# EAGLE design AP_KACA (EAGLE 8.4.1)
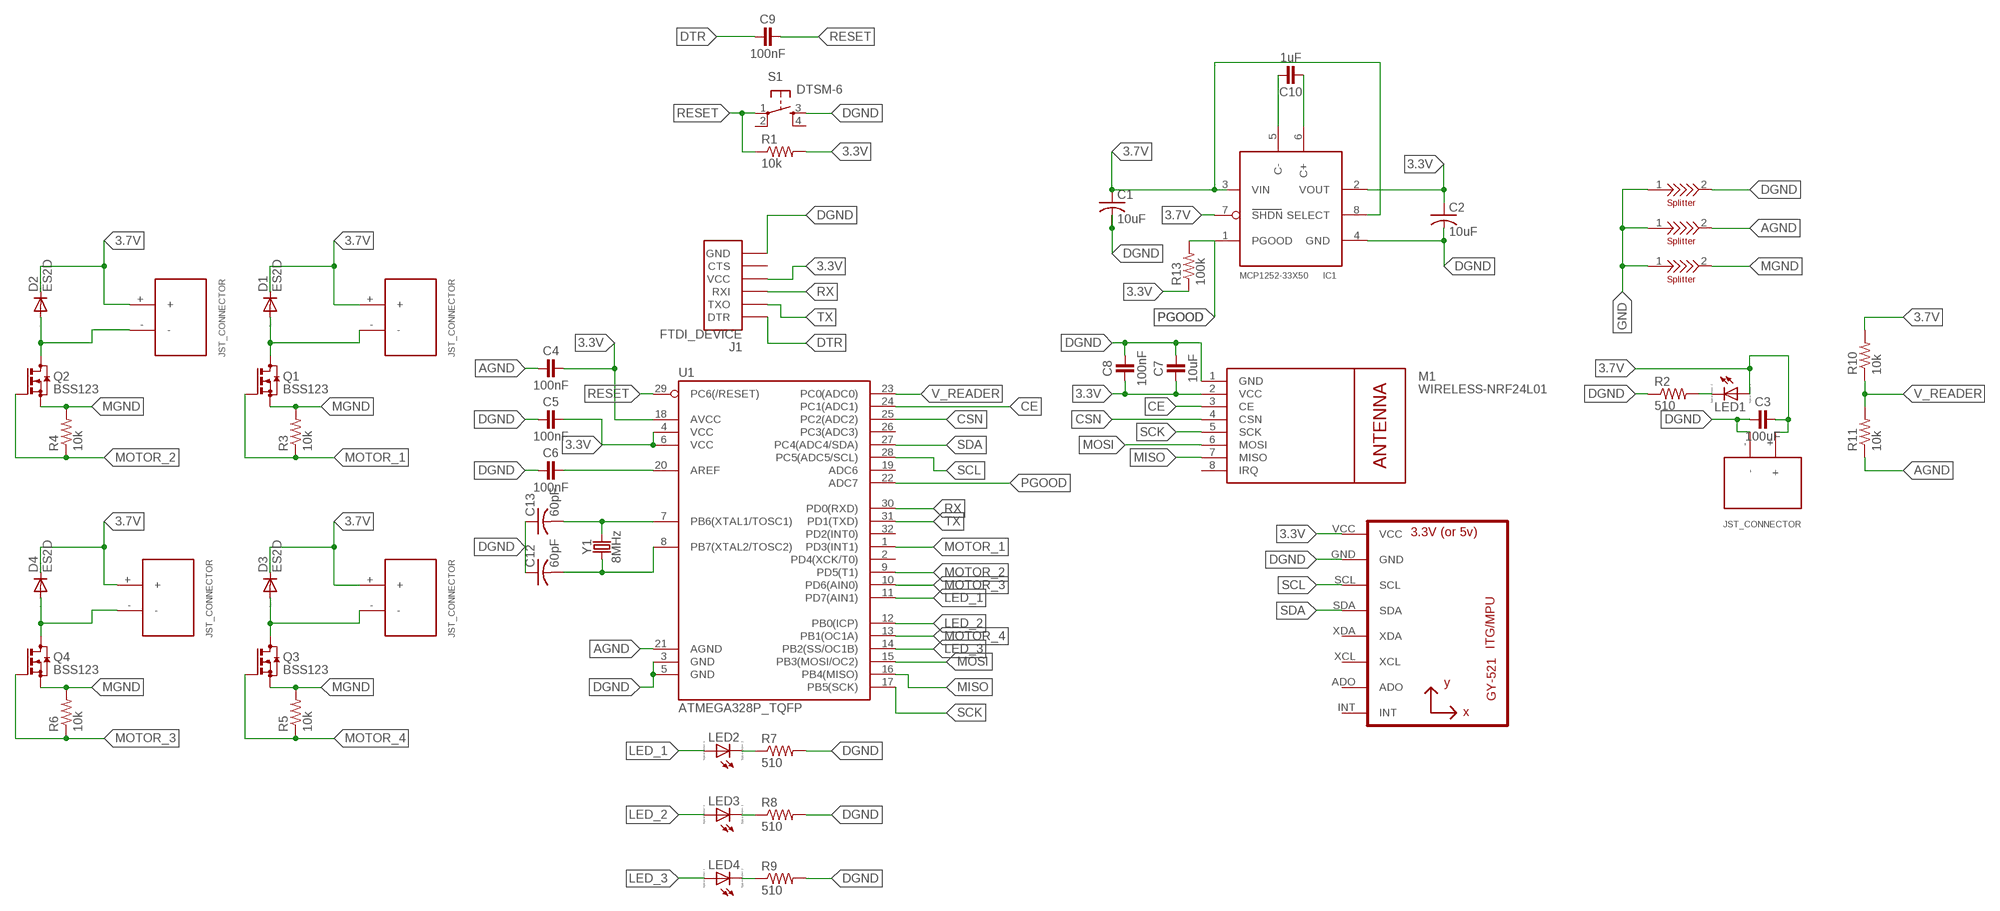
[diagram p0: schematic, sheet 1]

## Parts
C1  10uF  C-USC1206  [C1206]
C2  10uF  C-USC1206  [C1206]
C3  100uF  CAPACITOR-1206  [C1206]
C4  100nF  CAPACITOR-0603  [C0603]
C5  100nF  CAPACITOR-0603  [C0603]
C6  100nF  CAPACITOR-0603  [C0603]
C7  10uF  CAPACITOR-0603  [C0603]
C8  100nF  CAPACITOR-0603  [C0603]
C9  100nF  CAPACITOR-0603  [C0603]
C10  1uF  CAPACITOR-0603  [C0603]
C12  60pF  RCL_C-USC1206  [RCL_C1206]
C13  60pF  RCL_C-USC1206  [RCL_C1206]
D1  ES2D  [SMB]
D2  ES2D  [SMB]
D3  ES2D  [SMB]
D4  ES2D  [SMB]
IC1  MCP1252-33X50  [MSOP8]
J1  FTDI_DEVICE  [FTDI_DEVICE_SIDE]
JST_MOTOR_1  JST_MOTOR_1  JST_CONNECTOR_FEMALE  [JST_CONNECTOR_FEMALE]
LED1  LED_ESML0603  [LED_SML0603]
LED2  LED_ESML0603  [LED_SML0603]
LED3  LED_ESML0603  [LED_SML0603]
LED4  LED_ESML0603  [LED_SML0603]
M1  WIRELESS-NRF24L01  [WIRELESS-NRF24L01]
Q1  BSS123  [SOT23]
Q2  BSS123  [SOT23]
Q3  BSS123  [SOT23]
Q4  BSS123  [SOT23]
R1  10k  10.5KOHM1/10W1%(0603)  [0603]
R2  510  10.5KOHM1/10W1%(0603)  [0603]
R3  10k  10.5KOHM1/10W1%(0603)  [0603]
R4  10k  10.5KOHM1/10W1%(0603)  [0603]
R5  10k  10.5KOHM1/10W1%(0603)  [0603]
R6  10k  10.5KOHM1/10W1%(0603)  [0603]
R7  510  10.5KOHM1/10W1%(0603)  [0603]
R8  510  10.5KOHM1/10W1%(0603)  [0603]
R9  510  10.5KOHM1/10W1%(0603)  [0603]
R10  10k  10.5KOHM1/10W1%(0603)  [0603]
R11  10k  10.5KOHM1/10W1%(0603)  [0603]
R13  100k  10.5KOHM1/10W1%(0603)  [0603]
S1  DTSM-6  [DTSM-6]
U1  ATMEGA328P_TQFP  [TQFP32-08]
U3  GY-521MPU6050  [GY-521]
U$2  JST_CONNECTOR_FEMALE  [JST_CONNECTOR_FEMALE]
U$3  JST_CONNECTOR_FEMALE  [JST_CONNECTOR_FEMALE]
U$4  JST_CONNECTOR_FEMALE  [JST_CONNECTOR_FEMALE]
U$5  JST_CONNECTOR_FEMALE  [JST_CONNECTOR_FEMALE]
U$6  SPLITTER  [SPLITTER]
U$7  SPLITTER  [SPLITTER]
U$8  SPLITTER  [SPLITTER]
Y1  8MHz  CRYSTAL-8MHZSMD-HC49UP  [HC49UP]

## Nets
3.3V: C2.1 C4.2 C5.2 C7.1 C8.1 IC1.2(VOUT) J1.P$4(VCC) M1.2(VCC) R1.2 R13.1 U1.4(VCC) U1.6(VCC) U1.18(AVCC) U3.VCC
3.7V: C1.1 C3.2 D1.C D2.C D3.C D4.C IC1.3(VIN) IC1.7(SHDN) IC1.8(SELECT) JST_MOTOR_1.+ LED1.A R10.2 U$2.+ U$3.+ U$4.+ U$5.+
AGND: C4.1 R11.1 U1.21(AGND) U$6.2
CE: M1.3(CE) U1.24(PC1(ADC1))
CSN: M1.4(CSN) U1.25(PC2(ADC2))
DGND: C1.2 C2.2 C3.1 C5.1 C6.1 C7.2 C8.2 C12.1 C13.1 IC1.4(GND) J1.P$6(GND) M1.1(GND) R2.1 R7.2 R8.2 R9.2 S1.3 U1.3(GND) U1.5(GND) U3.GND U$2.- U$8.2
DTR: C9.1 J1.P$1(DTR)
GND: U$6.1 U$7.1 U$8.1
LED_1: LED2.A U1.11(PD7(AIN1))
LED_2: LED3.A U1.12(PB0(ICP))
LED_3: LED4.A U1.14(PB2(SS/OC1B))
MGND: Q1.2(S) Q2.2(S) Q3.2(S) Q4.2(S) R3.2 R4.2 R5.2 R6.2 U$7.2
MISO: M1.7(MISO) U1.16(PB4(MISO))
MOSI: M1.6(MOSI) U1.15(PB3(MOSI/OC2))
MOTOR_1: Q1.1(G) R3.1 U1.1(PD3(INT1))
MOTOR_2: Q2.1(G) R4.1 U1.9(PD5(T1))
MOTOR_3: Q4.1(G) R6.1 U1.10(PD6(AIN0))
MOTOR_4: Q3.1(G) R5.1 U1.13(PB1(OC1A))
N$1: D2.A Q2.3(D) U$3.-
N$2: D1.A JST_MOTOR_1.- Q1.3(D)
N$3: D3.A Q3.3(D) U$5.-
N$4: D4.A Q4.3(D) U$4.-
N$5: LED1.C R2.2
N$6: C13.2 U1.7(PB6(XTAL1/TOSC1)) Y1.2
N$7: C12.2 U1.8(PB7(XTAL2/TOSC2)) Y1.1
N$9: C6.2 U1.20(AREF)
N$11: C10.2 IC1.5(C-)
N$12: C10.1 IC1.6(C+)
N$15: LED3.C R8.1
N$16: LED2.C R7.1
N$17: LED4.C R9.1
PGOOD: IC1.1(PGOOD) R13.2 U1.22(ADC7)
RESET: C9.2 R1.1 S1.1 U1.29(PC6(/RESET))
RX: J1.P$3(RXI) U1.30(PD0(RXD))
SCK: M1.5(SCK) U1.17(PB5(SCK))
SCL: U1.28(PC5(ADC5/SCL)) U3.SCL
SDA: U1.27(PC4(ADC4/SDA)) U3.SDA
TX: J1.P$2(TXO) U1.31(PD1(TXD))
V_READER: R10.1 R11.2 U1.23(PC0(ADC0))
Unconnected: J1.P$5(CTS) M1.8(IRQ) S1.2 S1.4 U1.2(PD4(XCK/T0)) U1.19(ADC6) U1.26(PC3(ADC3)) U1.32(PD2(INT0)) U3.ADO U3.INT U3.XCL U3.XDA

## Library data of the parts
C1 C2 = resistor:C-US: CAPACITOR, American symbol
C3-C10 = we-rcl:CAPACITOR: Capacitors ...2.2uF @ 6.3V -> 0402 ...4.7uF @ 6.3V -> 0603 ...10uF @ 16V -> 0805 ...22uF @ 25V -> 1206
C12 C13 = OPS_Project_6_LIB:RCL_C-US: CAPACITOR, American symbol
D1-D4 = diode:ES2D: DIODE super fast rectifier, 2 A
IC1 = microchip-MCP125x-xxx:MCP1252-33X50: 650KHz 3.3V / 5.0V Selectable Switching Regulator
J1 = quad:FTDI_DEVICE: Connector which mates to FTDI basic or FTDI cable.
JST_MOTOR_1 U$2-U$5 = JST_CONNECTOR_FEMALE. through hole:JST_CONNECTOR_FEMALE
LED1-LED4 = eagle-ltspice:LED_E: LED Source: http://www.osram.convergy.de Source: www.luxeon.com Source: www.kingbright.com; SPICEMODEL: NONE; SPICEPREFIX: D; SPICETYPE: diode
M1 = quad:WIRELESS-NRF24L01: 2.4 GHz Wireless Module based on NRF24L01 chip
Q1-Q4 = transistor-small-signal:BSS123: N-CHANNEL MOS FET
R1-R11 R13 = SparkFun-Resistors:10.5KOHM1/10W1%(0603): RES-09570; PROD_ID: RES-09570; VALUE: 10.5k
S1 = switch-tact:DTSM-6
U1 = quad:ATMEGA328P_TQFP; PROD_ID: IC-09069
U3 = quad:GY-521
U$6-U$8 = splitter:SPLITTER
Y1 = SparkFun-Clocks:CRYSTAL-8MHZ: 8MHz Crystal Datasheet Example <http://www.futureelectronics.com/en/technologies/electromechanical/timing-devices/crystals/Pages/6008189-ABM3B-8.000MHZ-B2-T.aspx?IM=0> Frequency: 8MHz Frequency Tolerance: ±20ppm Load Capacitance: 18pF SparkFun Products: Pro Micro -3.3V/8MHz <https://www.sparkfun.com/products/12587> WAV Trigger <https://www.sparkfun.com/products/13660>; PROD_ID: XTAL-11706

## Board
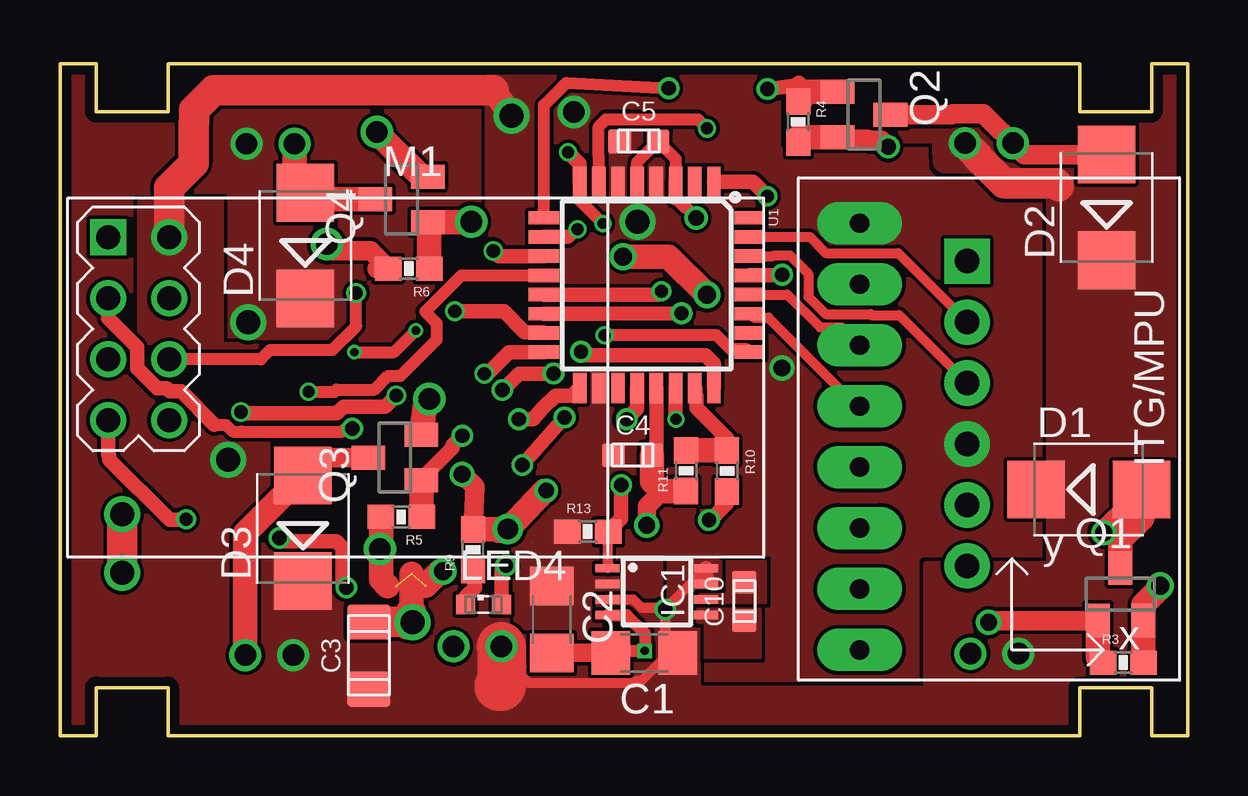
[diagram p1: board, top side]
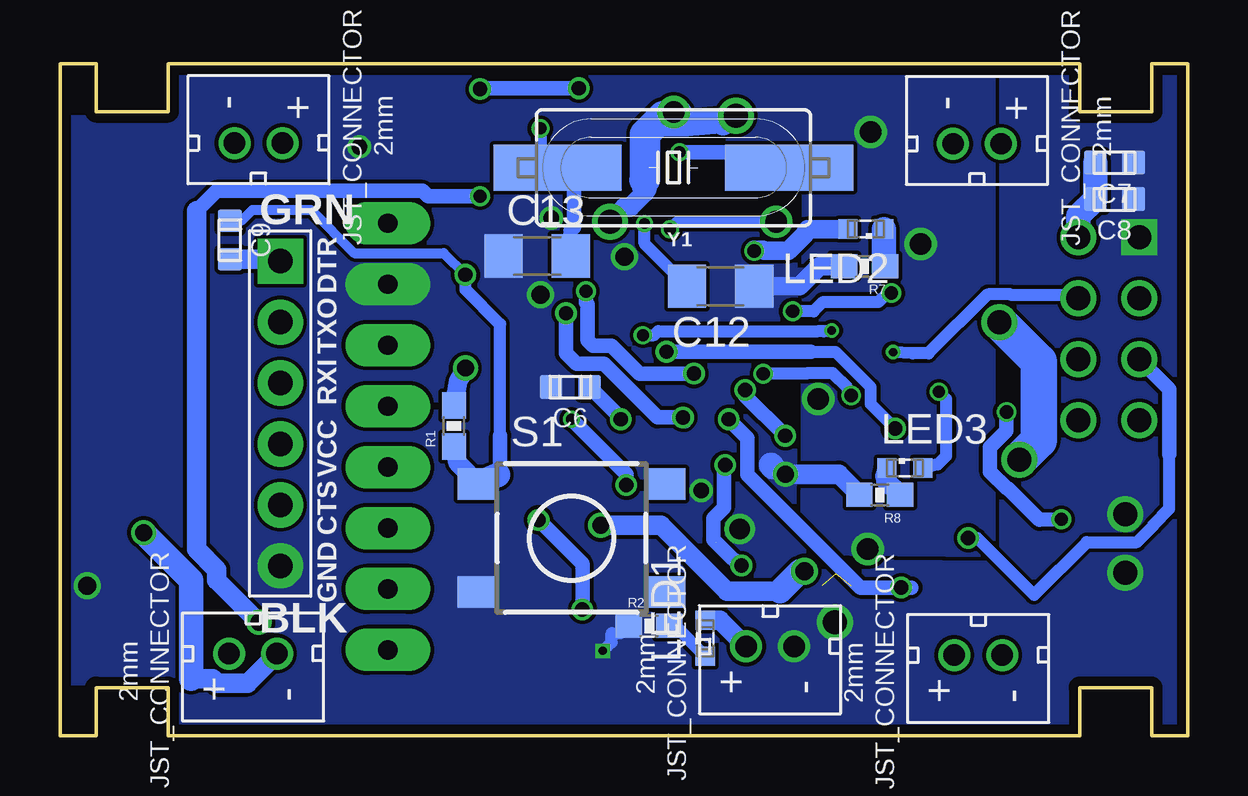
[diagram p2: board, bottom side, seen from below]

Size 47 x 28 mm. Coordinates in mm from the lower left corner, seen from the top.
Outline: 0,0 1.5,0 1.5,2 4.5,2 4.5,0 42.5,0 42.5,2 45.5,2 45.5,0 47,0 47,28 45.5,28 45.5,26 42.5,26 42.5,28 4.5,28 4.5,26 1.5,26 1.5,28 0,28 0,0
Copper layers (1*16): Top 0.035559375mm / dielectric 1.6mm / Bottom 0.035559375mm
Design rules "oshpark-2layer (2)": minimum track width 6mil, minimum drill 10mil, track to track 6mil, track to pad 6mil, pad to pad 6mil, via to via 6mil, smd to smd 6mil, copper to edge 15mil, drill to drill 6mil, minimum pad ring 5mil, minimum via ring 5mil, stop-mask expansion 2.5mil, vias tented up to drill 0mil, thermal gap 10mil

### Footprints (pad centres in the part's own frame; a part is rotated, then mirrored left to right if it is on the bottom)
C1206 = smd 1.6 x 1.8: 1 -1.4,0; 2 1.4,0
C1206' = smd 1.8 x 1.45: 1 0,1.4; 2 0,-1.4
C0603 = smd 1 x 0.95: 1 0,0.8; 2 0,-0.8
RCL_C1206 = smd 1.6 x 1.8: 1 -1.4,0; 2 1.4,0
SMB = smd 2.4 x 2.4: A 2.2,0; C -2.2,0
MSOP8 = smd 0.35 x 1: 1 -0.975,-2.05; 2 -0.325,-2.05; 3 0.325,-2.05; 4 0.975,-2.05; 5 0.975,2.05; 6 0.325,2.05; 7 -0.325,2.05; 8 -0.975,2.05
FTDI_DEVICE_SIDE = drill 1.016 pad 1.88 square: P$1 -6.35,0 | drill 1.016 pad 1.88: P$2 -3.81,0; P$3 -1.27,0; P$4 1.27,0; P$5 3.81,0; P$6 6.35,0
JST_CONNECTOR_FEMALE = drill 0.889: + 0,1; - 0,-1
LED_SML0603 = smd 0.8 x 0.8: A 0.75,0; C -0.75,0
WIRELESS-NRF24L01 = drill 1 square: 1 -12.7,6.35 | drill 1: 2 -10.16,6.35; 3 -12.7,3.81; 4 -10.16,3.81; 5 -12.7,1.27; 6 -10.16,1.27; 7 -12.7,-1.27; 8 -10.16,-1.27
SOT23 = smd 1 x 1.4: 1 -0.95,-1.1; 2 0.95,-1.1; 3 0,1.1
0603 = smd 1.1 x 1: 1 -0.85,0; 2 0.85,0
DTSM-6 = smd 1.55 x 1.3: 1 -3.975,2.25; 2 3.975,2.25; 3 -3.975,-2.25; 4 3.975,-2.25
TQFP32-08 = smd 1.27 x 0.559: 1 -4.293,2.8; 2 -4.293,2; 3 -4.293,1.2; 4 -4.293,0.4; 5 -4.293,-0.4; 6 -4.293,-1.2; 7 -4.293,-2; 8 -4.293,-2.8; 17 4.293,-2.8; 18 4.293,-2; 19 4.293,-1.2; 20 4.293,-0.4; 21 4.293,0.4; 22 4.293,1.2; 23 4.293,2; 24 4.293,2.8 | smd 0.559 x 1.27: 9 -2.8,-4.293; 10 -2,-4.293; 11 -1.2,-4.293; 12 -0.4,-4.293; 13 0.4,-4.293; 14 1.2,-4.293; 15 2,-4.293; 16 2.8,-4.293; 25 2.8,4.293; 26 2,4.293; 27 1.2,4.293; 28 0.4,4.293; 29 -0.4,4.293; 30 -1.2,4.293; 31 -2,4.293; 32 -2.8,4.293
GY-521 = drill 0.8 pad 1.778 long: ADO -8.89,-6.35; GND -8.89,6.35; INT -8.89,-8.89; SCL -8.89,3.81; SDA -8.89,1.27; VCC -8.89,8.89; XCL -8.89,-3.81; XDA -8.89,-1.27
SPLITTER = smd 0.102 x 0.102: 1 0,0; 2 0,0
HC49UP = smd 5.334 x 1.93: 1 -4.826,0; 2 4.826,0

### Placement (x,y rotation side)
C1  24.35,3.45 180 top
C2  20.5,4.84 270 top
C3  100uF  [C1206']  12.87,3.34 0 top
C4  23.88,11.68 270 top
C5  24.13,24.77 270 top
C6  25.73,14.53 90 bottom
C7  3.05,23.88 90 bottom
C8  3.05,22.35 90 bottom
C9  39.91,20.65 180 bottom
C10  28.52,5.59 0 top
C12  19.47,18.73 180 bottom
C13  27.11,19.99 0 bottom
D1  42.88,10.26 0 top
D2  43.63,22.01 90 top
D3  10.13,8.64 90 top
D4  10.23,20.42 90 top
IC1  24.88,6 270 top
J1  37.81,13.42 270 bottom
JST_MOTOR_1  38.95,3.42 90 bottom
LED1  20.11,4.06 90 bottom
LED2  13.41,21.11 180 bottom
LED3  11.79,11.15 0 bottom
LED4  17.65,5.46 0 top
M1  14.7,14.41 0 top
Q1  44.2,5.89 0 top
Q2  33.51,25.88 270 top
Q3  13.96,11.59 90 top
Q4  14.24,22.34 90 top
R1  30.58,12.9 90 bottom
R2  22.45,4.57 0 bottom
R3  44.32,3.05 0 top
R4  30.77,25.57 270 top
R5  14.23,9.12 180 top
R6  14.54,19.46 180 top
R7  13.46,19.56 180 bottom
R8  12.83,10.03 180 bottom
R9  17.22,7.75 90 top
R10  27.81,11.03 270 top
R11  26.1,11.04 90 top
R13  22,8.5 0 top
S1  25.68,8.23 0 bottom
U1  24.46,18.78 270 top
U3  42.22,12.46 0 top
U$2  17.4,3.72 90 bottom
U$3  38.72,24.69 270 bottom
U$4  8.78,24.66 270 bottom
U$5  8.73,3.36 90 bottom
U$6  15.24,6.25 0 top
U$7  14.02,6.22 90 top
U$8  14.66,6.76 0 top
Y1  21.43,23.66 180 bottom

### Tracks (layer width: path | path; a pad name or v marks a point on that pad's centre or on a via)
3.3V  (via drill 0.7, 0.9, 1)
  Top 1.016: 18.08,26.88 v18.82,25.83
  Top 1.27: 18.08,26.88 6.4,26.88 5.59,26.07 5.59,25.55 5.56,25.52 5.56,23.85 4.54,22.83 M1.2
  Bottom 0.762: v30.1,15.32 30.4,14.77 R1.2
  Bottom 0.813: 21.51,25.98 v21.41,25.98 | v24.08,21.41 23.47,22.02 23.23,22.02 22.63,22.62 22.63,22.8
  Bottom 1.016: M1.2 4.54,21.66 C8.1 C7.1 | 19.36,25.53 v18.82,25.83 19.46,25.6 20.88,25.48 21.97,25.48 21.18,25.98 v21.41,25.98 | 22.63,22.8 22.63,23.16
  Bottom 1.27: v21.41,25.98 21.59,25.81 21.86,25.81 22.61,25.06 22.61,23.18 22.63,23.16
  pour Top (rank 5, no thermals): 17.83,27.43 17.83,2.36 39.01,2.36 40.84,6.17 40.84,24.38 29.95,24.38 29.95,27.43
  pour Top (rank 3, no thermals): 3.35,22.25 6.71,22.33 6.71,16.31 17.75,16.23 17.75,12.73 5.79,12.8 3.35,12.8
3.7V  (via drill 0.6, 1)
  Top 0.406: v25.22,5.26 25.15,5.33 24.23,5.33 23.89,5.68 IC1.3 | v25.22,5.26 25.22,3.28 24.23,2.29 24,2.29 23.9,2.19 19.55,2.19 19.25,2.49 19.25,2.87 U$2.+ | IC1.8 v25.22,5.27 v25.22,5.26
  Top 0.61: 26.93,6.57 IC1.8 | R10.2 27.81,9.67 26.98,8.84 v27.05,8.99
  Top 1.27: 41.64,22.9 41.52,23.02 39.34,23.02 38.27,24.09 38.27,24.15 U$3.+
  Top 2.032: U$2.+ 18.4,2.06 18.29,2.06
  Bottom 0.61: v27.05,8.99 25.22,7.16 v25.22,5.26
  Bottom 0.813: U$2.+ 19.49,4.81 LED1.A
  Bottom 1.524: v7.85,17.22 6.21,15.58 6.21,12.31 v7.01,11.51
  pour Top (rank 6, no thermals): 0.3,27.89 46.79,27.89 46.79,0.23 0.38,0.23 0.38,27.81
  pour Top (rank 4, no thermals): 24.38,5.33 26.06,5.33 26.44,5.26 26.44,1.45 24.46,1.45 24.31,1.6 24.31,5.18 24.38,5.26
  pour Top (no thermals): 36.12,7.16 41.61,7.16 41.61,0.84 36.12,0.69
  pour Top (no thermals): 36.8,26.06 36.88,23.93 39.85,23.93 39.93,26.06 37.03,26.14
  pour Top (no thermals): 25.37,5.41 25.37,7.32 27.43,7.32 27.43,6.25 26.06,6.25 26.06,5.41
AGND  (via drill 0.7 pad 0.8, 0.75 pad 0.8)
  Top 0.61: U1.21 24.86,11.87 C4.1
  Top 0.762: 25.09,10.19 24.46,9.55 v24.46,8.76
  Top 1.016: C4.1 24.68,10.61 25.09,10.19 R11.1 | U$6.2 15.85,6.86 v15.97,6.86
  Bottom 0.762: 16.15,6.86 v15.97,6.86
  Bottom 0.813: v24.46,8.76 21.95,8.76 19.2,6.02 16.99,6.02
  Bottom 1.016: 16.99,6.02 16.15,6.86
CE  (via drill 0.6)
  Top 0.508: v12.19,12.8 11.91,12.8 11.78,12.67 7.61,12.67 7.59,12.66 7.58,12.67 7.21,12.67 7.2,12.67 6.92,12.95 6.44,12.95
  Top 0.61: U1.24 27.26,15.49 26.9,15.85 21.79,15.85 21.72,15.93 v21.72,15.99 | 6.44,12.95 5.04,14.35 4.57,14.35 4.45,14.47 4.04,14.47 3.21,15.31 3.21,16.18 2,17.39 M1.3
  Bottom 0.508: 15.69,15.99 14.68,15.99 13.2,14.51 13.2,13.81 v12.19,12.8
  Bottom 0.61: v21.72,15.99 15.69,15.99
CSN  (via drill 0.35, 0.5)
  Top 0.508: U1.25 28.64,16.09 27.95,16.09 27.36,16.69 v22.71,16.69 | v12.28,15.98 13.92,15.98 v14.82,16.88
  Bottom 0.508: v22.71,16.69 22.23,16.69 22.07,16.85 15.38,16.85 | 15.16,16.84 15.38,16.85 | M1.4 4.69,18.36 7.34,18.36 7.37,18.39 8.33,18.39 10.8,15.93 11.47,15.93 v12.28,15.98 | v14.82,16.88 14.85,16.85 15.38,16.85
DGND  (via drill 0.35, 0.65, 0.7, 0.75, 0.85, 1)
  Top 0.508: U1.5 24.06,23.89 C5.1 25.66,24.04 U1.3 | v26.52,21.57 26.05,22.03 26.01,22.03 25.66,22.38 | C1.2 23.04,3.54 v24.38,3.54 24.38,4.26 24.38,4.27 23.62,5.03 IC1.4 | 14.66,4.78 v14.71,4.72
  Top 0.61: U1.3 25.66,22.38
  Top 0.762: C1.2 C2.2
  Top 0.813: R9.2 17.3,10.36 v16.76,10.9
  Top 1.016: R9.2 18.23,8.6 18.29,8.53 v18.67,8.61 20.19,10.21 v20.27,10.21 | v23.47,19.96 25.38,19.96 v26.98,18.36 | U$8.2 14.66,4.78
  Top 1.27: v2.59,9.22 v2.59,6.78 | C3.1 14.39,4.74 14.48,4.65 14.55,4.65 v14.71,4.72 14.63,5.14
  Bottom 0.508: v24.38,3.54 24.38,3.51 | 24.38,3.51 24.38,3.5 | 24.38,3.51 24,3.89 24,4.27 23.6,4.27 R2.1
  Bottom 0.762: R7.2 15.34,19.56 16.17,18.73 C12.1
  Bottom 0.813: v16.76,10.9 14.54,10.9 R8.2
  Bottom 1.016: 17.27,11.18 17.37,11.28
  pour Bottom (rank 4, no thermals): 0.23,27.81 46.94,27.81 46.94,0.08 0.23,0.08
DTR
  Bottom 0.813: C9.1 38.65,19.86 J1.P$1
GND  (2 unrouted)
LED_1  (via drill 0.55)
  Top 0.61: U1.11 18.27,19.98 v18.06,20.19
  Bottom 0.508: 18.07,20.25 v18.06,20.19
  Bottom 0.762: LED2.A 15.77,21.11 | 15.85,21.11 15.77,21.11 | 15.77,21.11 15.94,20.94 15.94,20.91 16.64,20.2 17.65,20.2 17.7,20.25 18.07,20.25
LED_2  (via drill 0.5)
  Top 0.508: U1.12 16.73,19.18 15.22,17.66 15.72,17.16 15.72,16.52 14.2,14.99 13.68,14.99 13.11,14.42 11.52,14.42 11.43,14.33 v10.36,14.33
  Bottom 0.508: LED3.A 10.41,11.3 10.06,11.66 10.06,14.02 v10.36,14.33
LED_3  (via drill 0.6)  (1 unrouted)
  Top 0.61: U1.14 22.76,17.58 v25.91,17.6 | v21.03,13.26 v19.28,11.28 | v18.59,7.09 18.4,6.82 LED4.A
  Bottom 0.61: 20.95,13.11 v21.03,13.26 22.09,13.26 24.32,15.49 25.47,15.49 25.91,15.93 v25.91,17.6 | 19.65,8.06 18.99,7.4 18.98,7.4 v18.59,7.09 | 19.66,8.05 19.76,8.16 19.76,9.06 19.32,9.5 19.32,11.23 v19.28,11.28
MGND  (via drill 0.65, 0.75, 0.9)
  Top 0.305: 13.66,6.22 U$7.2
  Top 0.813: Q2.2 32.41,24.84 33.66,24.84 33.68,24.82 34.24,24.82 v34.52,24.54 | 13.21,19.46 R6.2 12.94,20.21 11.39,20.21 v11.12,20.48
  Top 1.016: Q3.2 15.21,13.77 v15.39,14.02 | 13.38,7.89 R5.2 | 13.38,7.89 v13.34,7.77 | R4.2 30.77,24.93 Q2.2 | R3.2 45.15,3.07 Q1.2 45.15,5.45 45.87,6.17 v45.87,6.25 | Q4.2 15.06,23.29 v13.21,25.15 | 13.66,6.22 13.38,6.51 13.38,7.89
  pour Bottom: 8.08,7.49 16.08,7.57 16,23.52 27.86,23.44 27.94,23.24 27.81,23.24 27.81,23.11 40.26,23.11 40.26,2.16 46.86,2.16 46.86,25.78 42.29,25.78 42.29,27.81 8.08,27.81
MISO  (via drill 0.55)
  Top 0.61: U1.16 18.72,15.98 17.75,15.01 v17.68,15.08 | v5.26,9.02 5.38,8.99 4.57,8.99 2.06,11.51 2.06,11.66 2,11.71 M1.7 | v7.54,13.49 7.53,13.43 11.54,13.43 11.82,13.71 13.56,13.71 v14.02,14.17
  Bottom 0.508: v14.02,14.17 14.16,14.39 14.16,14.47 14.79,15.1 15.84,15.1 15.86,15.08 v17.68,15.08
  Bottom 0.61: v5.26,9.02 6.17,8.99 7.47,10.29 7.51,10.29 8.23,11 8.23,12.01 7.54,12.7 v7.54,13.49
MOSI  (via drill 0.55)
  Top 0.508: M1.6 8.37,15.68 8.76,16.08 11.35,16.08 12.34,17.07 v12.34,18.44
  Top 0.61: U1.15 20.13,16.82 19.37,16.82 18.51,17.68 v16.46,17.68
  Bottom 0.508: v16.46,17.68 15.59,17.68 15.19,18.07 12.89,18.07 12.52,18.44 v12.34,18.44
MOTOR_1  (via drill 0.55, 0.7)
  Top 0.61: v29.49,22.48 28.9,23.07 U1.1
  Top 0.813: Q1.1 38.71,4.79 v38.71,4.72
  Top 1.016: Q1.1 43.25,3.27 R3.1
  Bottom 0.61: v29.49,22.48 31.66,22.48 31.88,22.7 40.47,22.7 41.3,21.87
  Bottom 0.813: v38.71,4.72 40.46,6.48 40.46,6.92 41.3,7.76 41.3,21.87
MOTOR_2  (via drill 0.6)
  Top 0.508: U1.9 20.17,26.27 20.96,27.07 20.97,27.07 21.11,27.2 v25.38,26.98
  Top 0.61: 31.18,26.83 30.8,27.2 30.69,27.09 v29.49,26.94
  Top 1.016: R4.1 31.18,26.83 Q2.1
  Bottom 0.61: v25.38,26.98 29.41,26.98 v29.49,26.94
MOTOR_3  (via drill 0.5, 0.9)
  Top 0.508: v21.57,21.11 21.24,20.78 21.16,20.78
  Top 0.61: 21.16,20.78 U1.10
  Top 1.016: R6.1 15.39,21.34 Q4.1 17.12,21.39 v17.14,21.41
  Bottom 0.508: v21.57,21.11 21.26,21.41 v17.14,21.41
  Bottom 1.016: v17.14,21.41 17.22,21.34
MOTOR_4  (via drill 0.55, 0.6)
  Top 0.61: v16.76,12.5 16.37,12.1 16.37,12 15.21,10.84 Q3.1 | v20.57,15.09 19.13,15.09 v18.44,14.4 | U1.13 24.93,18.38 v25.07,18.52
  Top 1.016: Q3.1 15.08,10.65 R5.1
  Bottom 0.61: 20.57,15.16 v20.57,15.09 22.84,15.09 24.01,16.25 24.78,16.25 25,16.47 25,17.98 25.07,18.05 v25.07,18.52 | v18.44,14.4 18.44,14.17 v16.76,12.5
N$1
  Top 0.813: D2.A 40.21,24.21 39.98,24.43 | 39.98,24.43 U$3.- | Q2.3 37.17,25.88 37.22,25.92 38.5,25.92 39.98,24.43
N$2  (via drill 0.7)
  Top 1.016: Q1.3 44.2,8.16 45.11,9.07 45.11,9.98 | D1.A 45.11,10.23 45.11,9.98 | v43.51,8.46 45.11,9.98
  Bottom 0.813: 41.53,2.36 40.63,2.36 40.46,2.19 39.18,2.19 JST_MOTOR_1.-
  Bottom 1.016: 41.53,2.36 41.53,6.48 v43.51,8.46
N$3
  Top 0.813: Q3.3 10.88,11.59 D3.A
  Top 1.016: U$5.- 7.73,8.44 D3.A
N$4
  Top 1.016: U$4.- 9.78,23.07 D4.A 10.51,22.34 Q4.3
N$5
  Bottom 0.508: R2.2 21.37,4.57 LED1.C
N$6  (via drill 0.5)
  Top 0.508: U1.7 22.46,24.14 22.45,24.15 22.45,25.38 22.75,25.68 26.59,25.68 v26.98,25.3
  Bottom 0.508: v26.98,25.3 26.98,24.46 Y1.2
  Bottom 0.61: C13.2 25.71,21.04 25.57,21.17 25.57,22.98 Y1.2
N$7  (via drill 0.45, 0.5)
  Top 0.508: v22.63,21.34 21.66,22.31 U1.8
  Top 0.61: U1.8 21.66,23.83 v21.18,24.31
  Bottom 0.508: C12.2 22.5,20.36 22.5,20.37 22.63,20.5 v22.63,21.34
  Bottom 0.61: v21.18,24.31 17.25,24.31 Y1.1
N$9  (via drill 0.6)
  Top 0.61: U1.20 24.06,13.62 v23.62,13.18
  Bottom 0.61: v23.62,13.18 23.62,13.22 C6.2
N$11
  pour Top (no thermals): 26.59,5.26 29.18,5.26 29.18,3.28 26.9,3.28 26.9,4.72 26.59,4.72
N$12
  pour Top (no thermals): 26.67,5.56 29.41,5.56 29.41,7.24 27.81,7.24 27.81,5.87 26.67,5.87 26.67,5.64
N$15
  Bottom 0.813: R8.1 12.57,10.62 12.57,10.76 12.61,10.81 LED3.C
N$16
  Bottom 1.016: LED2.C 12.66,19.61 R7.1
N$17
  Top 0.61: R9.1 17.3,6.17 16.9,5.78 LED4.C
PGOOD  (via drill 0.45, 0.6)
  Top 0.406: IC1.1 22.85,7.22 R13.2
  Top 0.61: U1.22 25.66,13.2 v25.68,13.18 | R13.2 23.39,9.04 v23.39,10.44
  Bottom 0.61: v25.68,13.18 23.39,10.9 v23.39,10.44
RESET  (via drill 0.6)
  Top 0.61: U1.29 30.08,19.18 v30.1,19.2
  Bottom 0.406: C9.2 39.43,21.45 38.98,21.91 36.53,21.91 34.73,20.11 31,20.11 v30.1,19.2
  Bottom 0.508: 28.65,12.5 28.65,17.14 30.1,18.59 v30.1,19.2
  Bottom 0.61: 28.65,12.5 28.65,10.95 S1.1
  Bottom 0.762: R1.1 30.43,11.38 29.99,10.94 S1.1
  Bottom 1.016: S1.1 28.74,10.86 28.75,10.85
RX
  Top 0.406: U1.30 29.74,19.98 29.77,20.01 30.43,20.01 31.2,19.24 31.2,18.3 31.93,17.57 33.79,17.57 33.83,17.53 34.98,17.53 J1.P$3
SCK  (via drill 0.6)
  Top 0.61: U1.17 21.34,14.17 20.66,14.17 20.12,13.63 19.72,13.18 v19.13,13.18 | v11.93,6.17 11.79,6.32 11.79,7.83 11.52,8.1 9.14,8.1 v9.14,8.24
  Bottom 0.508: v9.14,8.24 8.78,8.24 6.4,5.87 4.2,8.06 2.11,8.06 1.43,8.74 1.43,8.78 0.76,9.45 0.76,11.73
  Bottom 0.61: v19.13,13.18 18.34,12.39 18.34,10.88 13.63,6.17 v11.93,6.17 11.51,6.17 | v9.13,8.23 v9.14,8.24 | M1.5 0.76,14.44 0.76,11.73
SCL
  Top 0.406: U3.SCL 32.59,17.01 31.69,17.01 30.32,18.38 U1.28
SDA
  Top 0.406: U1.27 28.92,17.41 29.54,17.41 33.22,13.73 U3.SDA
TX
  Top 0.406: U1.31 31.25,20.78 31.93,20.11 34.94,20.11 J1.P$2
V_READER
  Top 0.61: R10.1 27.8,12.38 26.52,13.66 26.52,14.15 26.5,14.17 26.5,14.45 U1.23
  Top 1.016: R11.2 R10.1